# Altium project Coral Dev Board Micro.PrjPcb (part 5 of 5)

## Sheet 15 BOOT.SchDoc: Coral 6 Layer Template With Controlled Impedances
size A2; ApprovedBy: DNP; CheckedBy: DNP; Author: DNP; CompanyName: Google LLC; DrawnBy: DNP; Engineer: Stefan; Organization: Google LLC; Address1: 1600 Amphitheatre Parkway; Address2: Mountain View, CA 94043; Address3: DNP; Address4: DNP; DocumentNumber: 15; Revision: PVT; SheetNumber: 15; SheetTotal: 17; VersionControl_RevNumber: DNP; IsUserConfigurable: DNP; Time: DNP; ImagePath: DNP; Rule: DNP; ProjectName: Enterprise; Application_BuildNumber: DNP
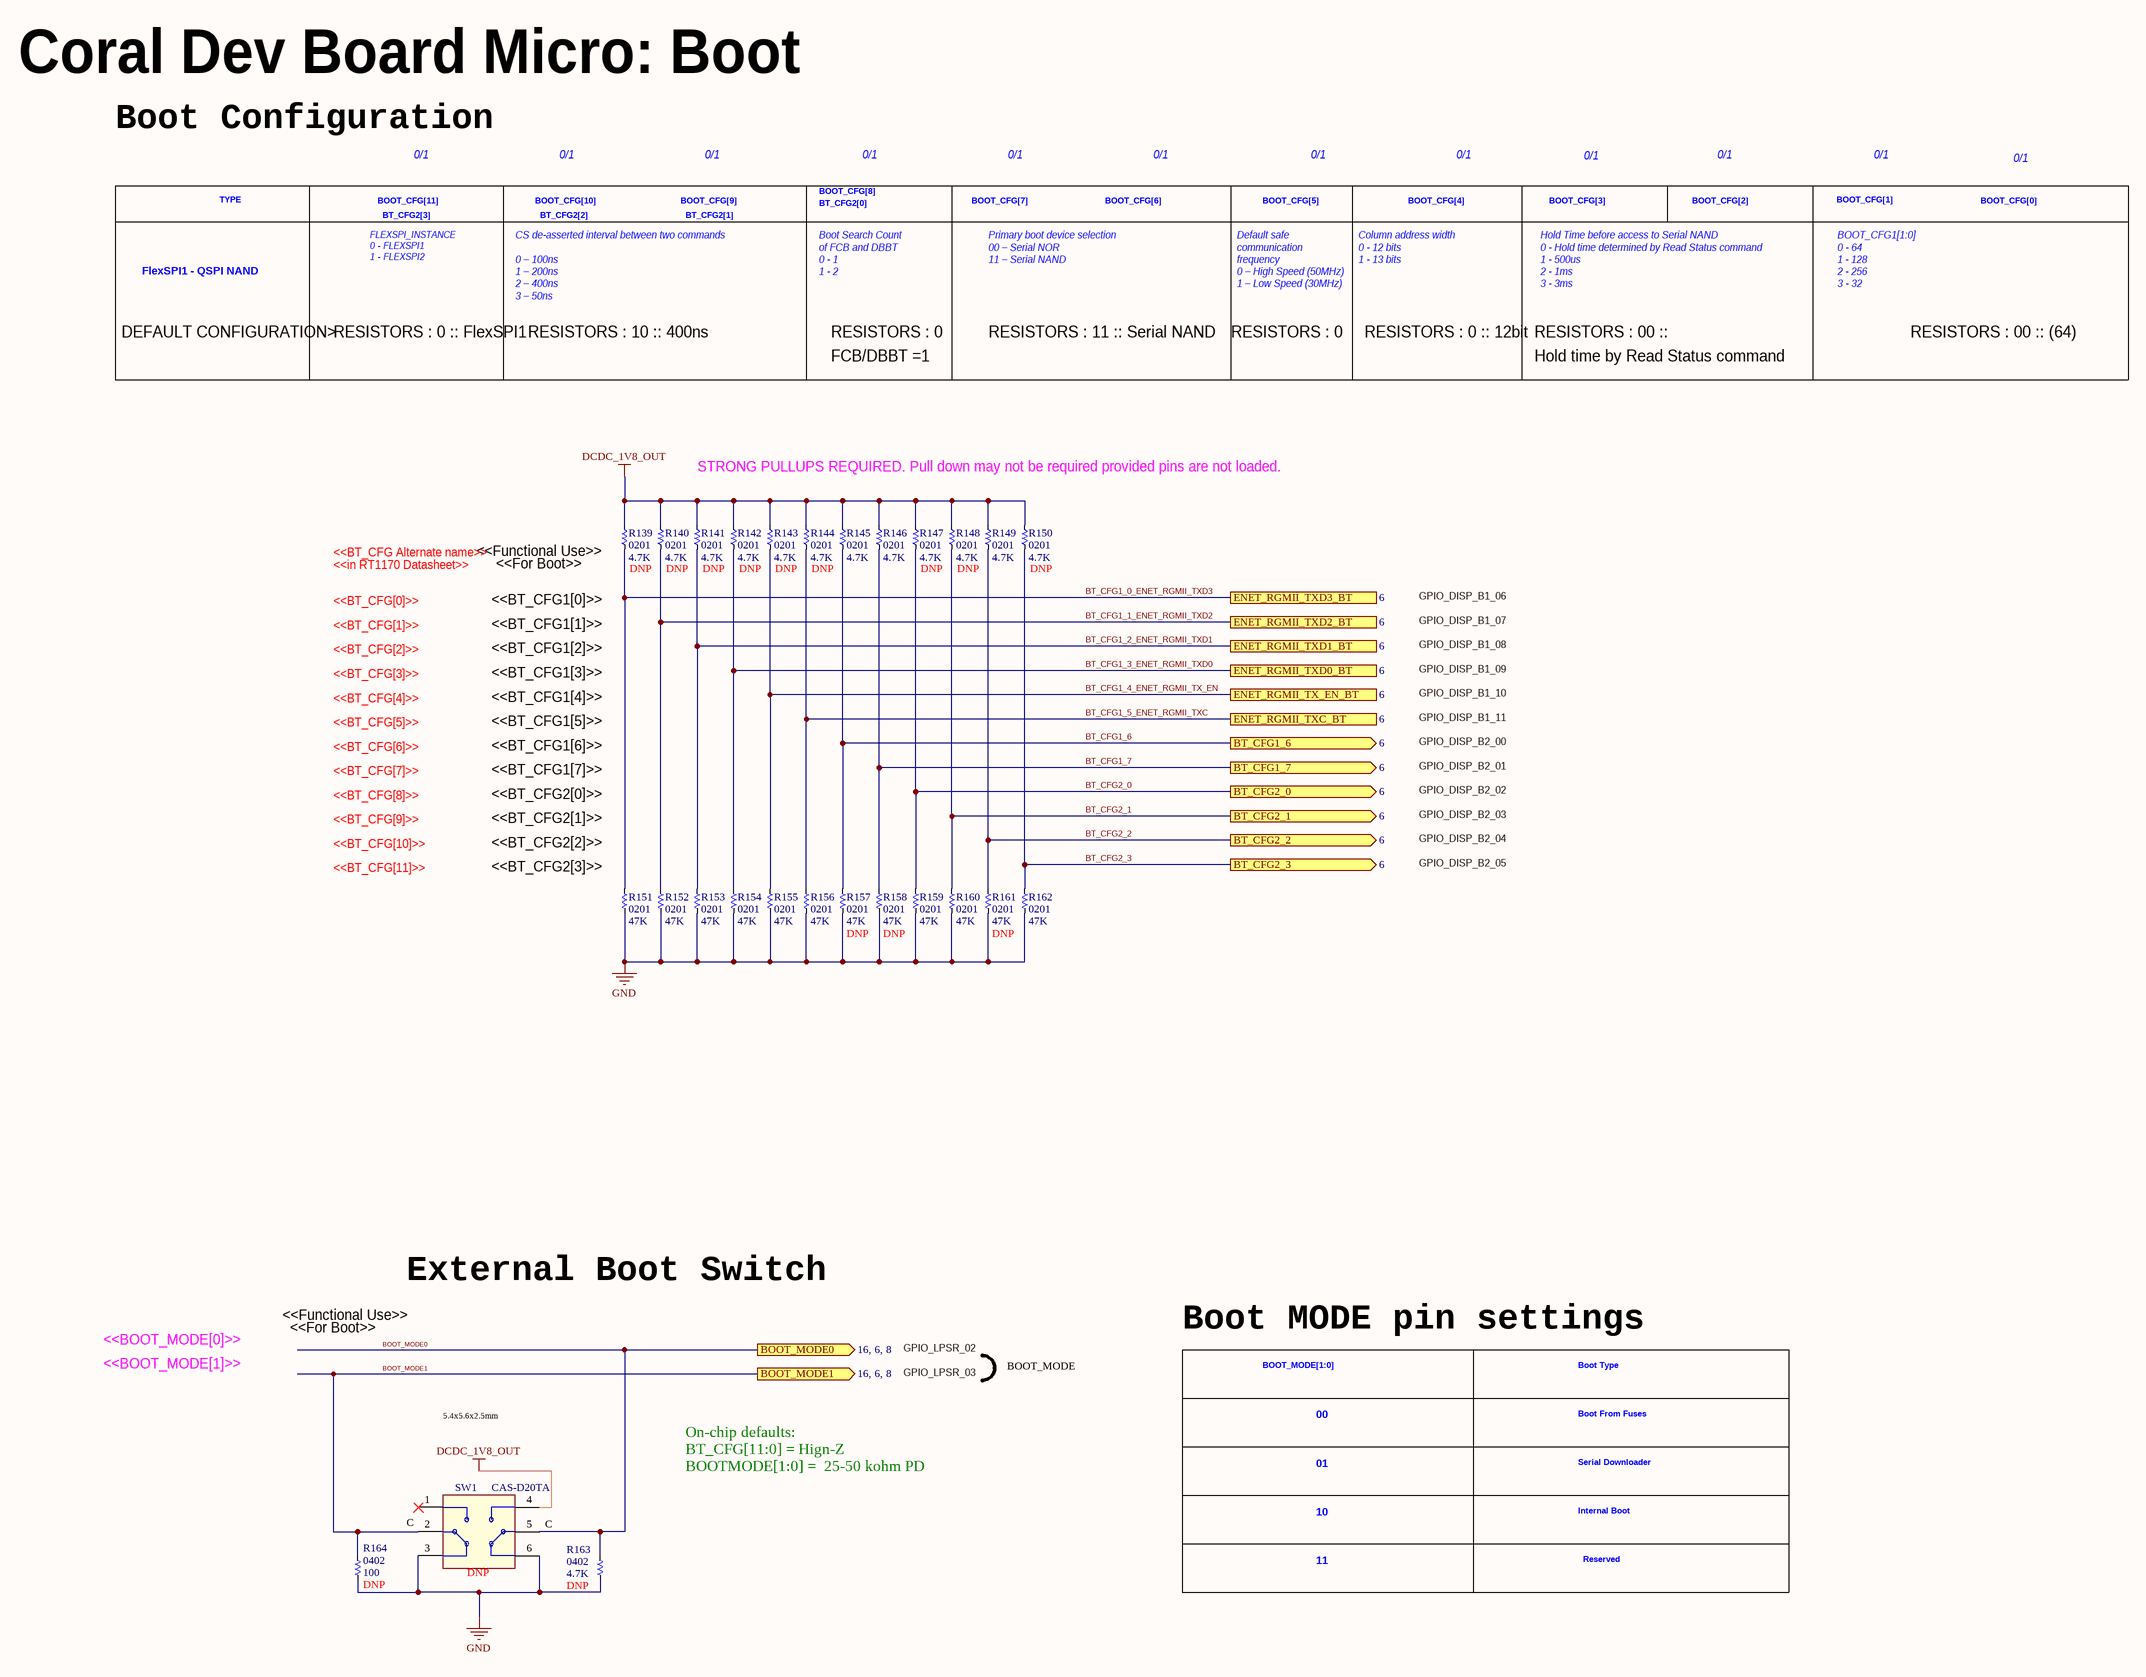
[diagram p20: 15 BOOT.SchDoc]

### Parts
R139  value 4.7K  Package: 0201  [R0201]
R140  value 4.7K  Package: 0201  [R0201]
R141  value 4.7K  Package: 0201  [R0201]
R142  value 4.7K  Package: 0201  [R0201]
R143  value 4.7K  Package: 0201  [R0201]
R144  value 4.7K  Package: 0201  [R0201]
R145  value 4.7K  Package: 0201  [R0201]
R146  value 4.7K  Package: 0201  [R0201]
R147  value 4.7K  Package: 0201  [R0201]
R148  value 4.7K  Package: 0201  [R0201]
R149  value 4.7K  Package: 0201  [R0201]
R150  value 4.7K  Package: 0201  [R0201]
R151  value 47K  Package: 0201  [R0201]
R152  value 47K  Package: 0201  [R0201]
R153  value 47K  Package: 0201  [R0201]
R154  value 47K  Package: 0201  [R0201]
R155  value 47K  Package: 0201  [R0201]
R156  value 47K  Package: 0201  [R0201]
R157  value 47K  Package: 0201  [R0201]
R158  value 47K  Package: 0201  [R0201]
R159  value 47K  Package: 0201  [R0201]
R160  value 47K  Package: 0201  [R0201]
R161  value 47K  Package: 0201  [R0201]
R162  value 47K  Package: 0201  [R0201]
R163  value 4.7K  Package: 0402  [R0402]
R164  value 100  Package: 0402  [R0402]
SW1  MFG P/N: CAS-D20TA  [SWITCH_CAS-D20TA]  (hidden comment: SWITCH_NIDEC_CAS-D20TA)

### Ports
BOOT_MODE0 (out, see 16, 6, 8), BOOT_MODE1 (out, see 16, 6, 8), BT_CFG1_6 (out, see 6), BT_CFG1_7 (out, see 6), BT_CFG2_0 (out, see 6), BT_CFG2_1 (out, see 6), BT_CFG2_2 (out, see 6), BT_CFG2_3 (out, see 6), ENET_RGMII_TX_EN_BT (see 6), ENET_RGMII_TXC_BT (see 6), ENET_RGMII_TXD0_BT (see 6), ENET_RGMII_TXD1_BT (see 6), ENET_RGMII_TXD2_BT (see 6), ENET_RGMII_TXD3_BT (see 6)

### Nets
DCDC_1V8_OUT: R139.2 R140.2 R141.2 R142.2 R143.2 R144.2 R145.2 R146.2 R147.2 R148.2 R149.2 R150.2 SW1.4
GND: R151.2 R152.2 R153.2 R154.2 R155.2 R156.2 R157.2 R158.2 R159.2 R160.2 R161.2 R162.2 R163.1 R164.1 SW1.3 SW1.6
BOOT_MODE0: R163.2 SW1.5 ; port BOOT_MODE0
BOOT_MODE1: R164.2 SW1.2 ; port BOOT_MODE1
BT_CFG1_0_ENET_RGMII_TXD3: R139.1 R151.1 ; port ENET_RGMII_TXD3_BT
BT_CFG1_1_ENET_RGMII_TXD2: R140.1 R152.1 ; port ENET_RGMII_TXD2_BT
BT_CFG1_2_ENET_RGMII_TXD1: R141.1 R153.1 ; port ENET_RGMII_TXD1_BT
BT_CFG1_3_ENET_RGMII_TXD0: R142.1 R154.1 ; port ENET_RGMII_TXD0_BT
BT_CFG1_4_ENET_RGMII_TX_EN: R143.1 R155.1 ; port ENET_RGMII_TX_EN_BT
BT_CFG1_5_ENET_RGMII_TXC: R144.1 R156.1 ; port ENET_RGMII_TXC_BT
BT_CFG1_6: R145.1 R157.1 ; port BT_CFG1_6
BT_CFG1_7: R146.1 R158.1 ; port BT_CFG1_7
BT_CFG2_0: R147.1 R159.1 ; port BT_CFG2_0
BT_CFG2_1: R148.1 R160.1 ; port BT_CFG2_1
BT_CFG2_2: R149.1 R161.1 ; port BT_CFG2_2
BT_CFG2_3: R150.1 R162.1 ; port BT_CFG2_3

Not connected (* = marked no-connect by the designer): SW1 1*

### Notes on the sheet
- Coral Dev Board Micro: Boot
- Boot Configuration
- 0/1
- TYPE
- BOOT_CFG[11]
- BT_CFG2[3]
- BOOT_CFG[10]
- BT_CFG2[2]
- BOOT_CFG[9]
- BT_CFG2[1]
- BOOT_CFG[8]
- BT_CFG2[0]
- BOOT_CFG[7]
- BOOT_CFG[6]
- BOOT_CFG[5]
- BOOT_CFG[4]
- BOOT_CFG[3]
- BOOT_CFG[2]
- BOOT_CFG[1]
- BOOT_CFG[0]
- FlexSPI1 - QSPI NAND
- FLEXSPI_INSTANCE
  0 - FLEXSPI1
  1 - FLEXSPI2
- Boot Search Count
  of FCB and DBBT
  0 - 1
  1 - 2
- Primary boot device selection
  00 – Serial NOR
  11 – Serial NAND
- Column address width
  0 - 12 bits
  1 - 13 bits
- BOOT_CFG1[1:0]
  0 - 64
  1 - 128
  2 - 256
  3 - 32
- DEFAULT CONFIGURATION>
- RESISTORS : 0 :: FlexSPI1
- CS de-asserted interval between two commands
  0 – 100ns
  1 – 200ns
  2 – 400ns
  3 – 50ns
- RESISTORS : 10 :: 400ns
- RESISTORS : 0
- RESISTORS : 11 :: Serial NAND
- Default safe
  communication
  frequency
  0 – High Speed (50MHz)
  1 – Low Speed (30MHz)
- RESISTORS : 0 :: 12bit
- RESISTORS : 00 ::
- Hold Time before access to Serial NAND
  0 - Hold time determined by Read Status command
  1 - 500us
  2 - 1ms
  3 - 3ms
- RESISTORS : 00 :: (64)
- FCB/DBBT =1
- Hold time by Read Status command
- STRONG PULLUPS REQUIRED. Pull down may not be required provided pins are not loaded.
- <<BT_CFG Alternate name>>
- <<in RT1170 Datasheet>>
- (near R139) <<Functional Use>>
- (near R139) <<For Boot>>
- <<BT_CFG[0]>>
- <<BT_CFG[1]>>
- <<BT_CFG1[0]>>
- <<BT_CFG1[1]>>
- GPIO_DISP_B1_06
- GPIO_DISP_B1_07
- GPIO_DISP_B1_08
- <<BT_CFG[2]>>
- <<BT_CFG[3]>>
- <<BT_CFG[4]>>
- <<BT_CFG1[2]>>
- <<BT_CFG1[3]>>
- <<BT_CFG1[4]>>
- GPIO_DISP_B1_09
- GPIO_DISP_B1_10
- <<BT_CFG[5]>>
- <<BT_CFG[6]>>
- <<BT_CFG1[5]>>
- <<BT_CFG1[6]>>
- GPIO_DISP_B1_11
- GPIO_DISP_B2_00
- GPIO_DISP_B2_01
- <<BT_CFG[7]>>
- <<BT_CFG[8]>>
- <<BT_CFG[9]>>
- <<BT_CFG1[7]>>
- <<BT_CFG2[0]>>
- <<BT_CFG2[1]>>
- GPIO_DISP_B2_02
- GPIO_DISP_B2_03
- <<BT_CFG[10]>>
- <<BT_CFG[11]>>
- <<BT_CFG2[2]>>
- (near R151) <<BT_CFG2[3]>>
- GPIO_DISP_B2_04
- GPIO_DISP_B2_05
- External Boot Switch
- <<BOOT_MODE[0]>>
- <<BOOT_MODE[1]>>
- <<For Boot>>
- <<Functional Use>>
- GPIO_LPSR_02
- GPIO_LPSR_03
- BOOT_MODE
- Boot MODE pin settings
- BOOT_MODE[1:0]
- Boot Type
- 5.4x5.6x2.5mm
- 00
- Boot From Fuses
- On-chip defaults:
  BT_CFG[11:0] = Hign-Z
  BOOTMODE[1:0] =  25-50 kohm PD
- 01
- Serial Downloader
- 10
- Internal Boot
- 11
- Reserved
- Project:
- Engineer:
- Date:
- File:
- Revision:
- Sheet
- of
- (in symbol 227) C

### Library data of the parts
R139-R150 = 6602: RES, 4.7K, 5%, 1/20W, 0201; ID: 6602; MFG: YAGEO; MFG P/N: RC0201JR-074K7L; COMMON: 470-00012-00; Status: Released; Power: 1/20W; Tolerance: 5%; LOON: 470-00012-00; Gecko: 470-00012-00; XPN: 470-00012-00
  R139-R144 R147 R148 R150: DNP: DNP
R151-R162 = 6833: RES, 47K, 5%, 1/20W, 0201; ID: 6833; MFG: PANASONIC; MFG P/N: ERJ1GEJ473C; COMMON: 470-00003-00; Status: NRND; Power: 1/20W; Tolerance: 5%; LOON: 470-00003-00; Gecko: 470-00003-00; XPN: 470-00003-00
  R157 R158 R161: DNP: DNP
R163 = 3866: RES, 4.7K, 1%, 1/10W, 0402; ID: 3866; MFG: PANASONIC; MFG P/N: ERJ-2RKF4701X; COMMON: 470-01775-00; PROXY: Use ID #8133; KOI: 470-17107-00; Status: Released; Power: 1/10W; Tolerance: 1%; Height: 0.40mm; Supplier 1: Digi-Key; XPN: 470-01775-00; Supplier Part Number 1: P4.70KLCT-ND; DNP: DNP
R164 = 6318: RES, 100, 5%, 1/16W, 0402, AUTO GRADE; ID: 6318; MFG: VISHAY; MFG P/N: CRCW0402100RJNED; COMMON: 470-02903-00; Status: Released; Power: 1/16W; Tolerance: 5%; XPN: 470-02903-00; DNP: DNP
SW1 = 227: SW, SLIDE, SPDTx2, 100mA, 6VDC, 2-POS, ON-ON, GOLD, SMT; ID: 227; MFG: Nidec Copal Electronics; Voltage, Rated: 6V; Status: Released; Category: Slide Switches; RoHS Compliant: Yes; Supplier 1: Digi-Key; Height: 2.5mm; Mounting Type: SMD; HelpURL: https://www.digikey.com/en/products/detail/nidec-copal-electronics/CAS-D20TA/341665; ComponentLink1Description: Datasheet; ComponentLink1URL: https://drive.google.com/file/d/1yHSGEBNR3CK8ELRyOJmK0djXwn1fRk_2/view; Supplier Part Number 1: CASD20JTR-ND; Features: Tape Seal; Operating Temperature: -40°C ~ 85°C; DNP: DNP

## Sheet 16 INTERFACE.SchDoc: Coral 6 Layer Template With Controlled Impedances
size A2; ApprovedBy: DNP; CheckedBy: DNP; Author: DNP; CompanyName: Google LLC; DrawnBy: DNP; Engineer: Stefan; Organization: Google LLC; Address1: 1600 Amphitheatre Parkway; Address2: Mountain View, CA 94043; Address3: DNP; Address4: DNP; DocumentNumber: 16; Revision: PVT; SheetNumber: 16; SheetTotal: 17; VersionControl_RevNumber: DNP; IsUserConfigurable: DNP; Time: DNP; ImagePath: DNP; Rule: DNP; ProjectName: Enterprise; Application_BuildNumber: DNP
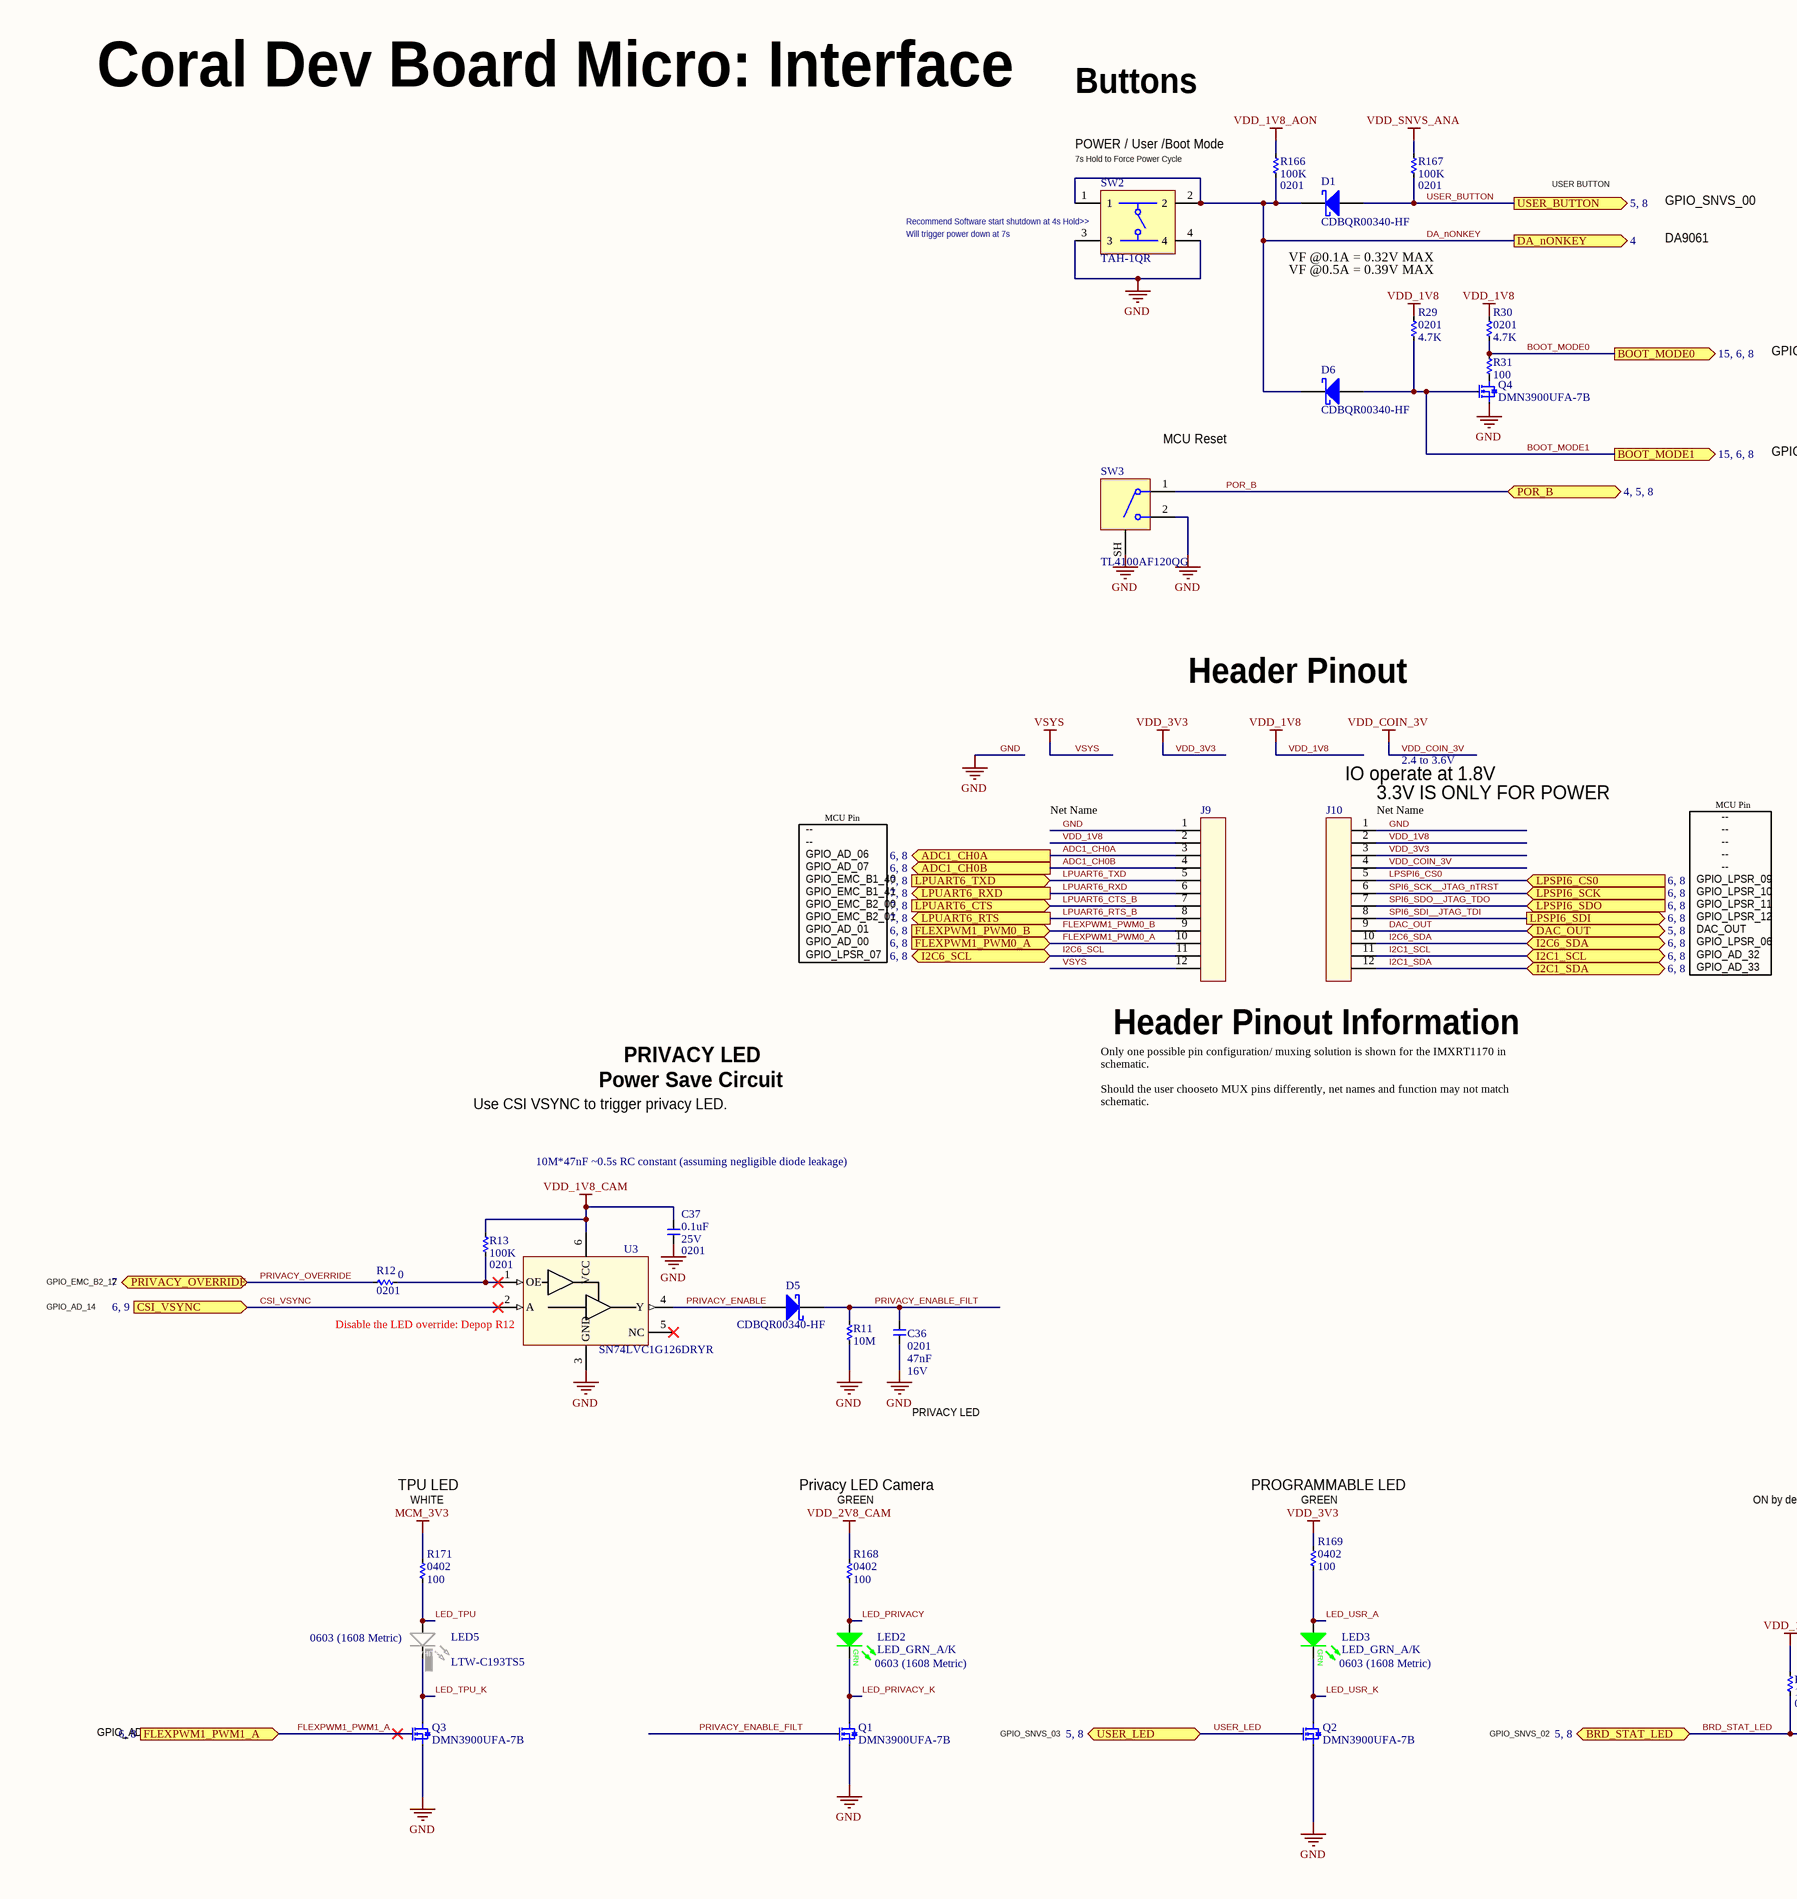
[diagram p21: 16 INTERFACE.SchDoc, left]
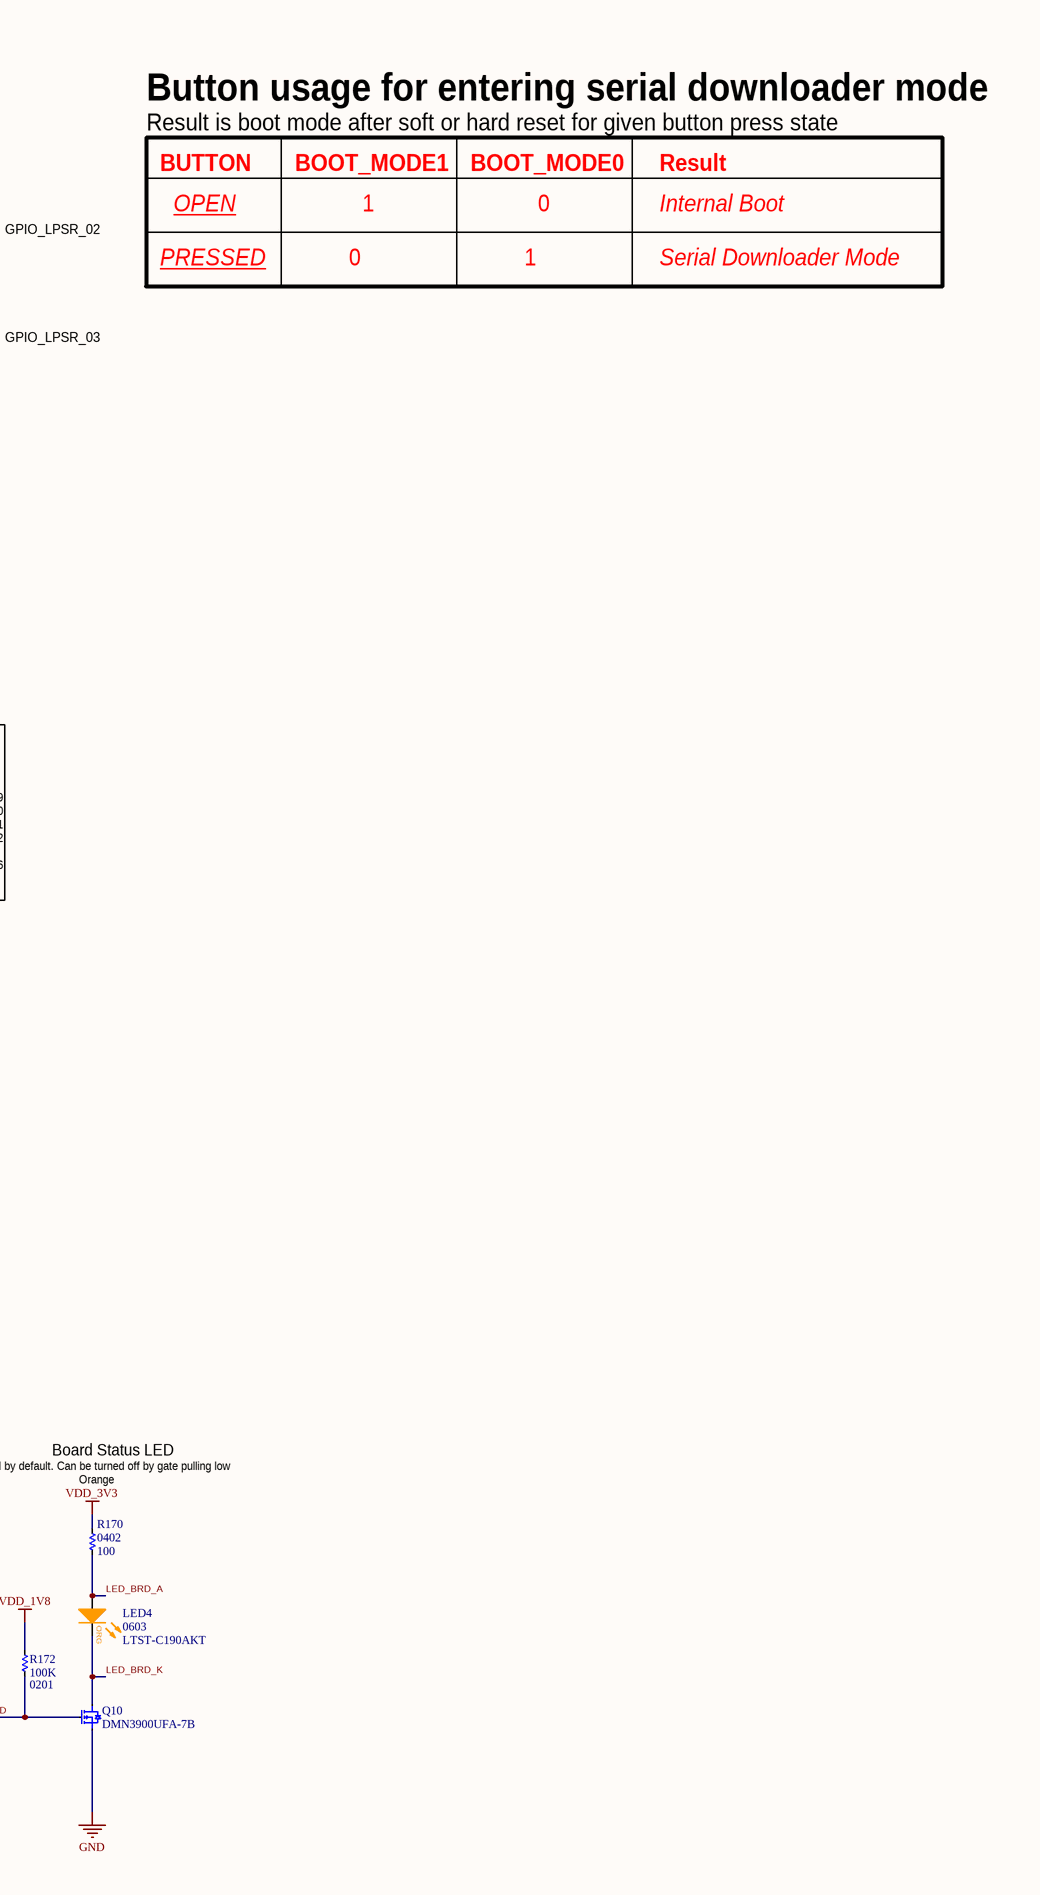
[diagram p22: 16 INTERFACE.SchDoc, right]

### Parts
C36  value 47nF  Package: 0201  Voltage: 16V  [C0201]  (hidden comment: __Template_Cap)
C37  value 0.1uF  Package: 0201  Voltage: 25V  [C0201Y]  (hidden comment: __Template_Cap)
D1  value CDBQR00340-HF  [D0402_H0.55MM]  (hidden comment: __Template_DIODE_SCHOTTKY)
D5  value CDBQR00340-HF  [D0402_H0.55MM]  (hidden comment: __Template_DIODE_SCHOTTKY)
D6  value CDBQR00340-HF  [D0402_H0.55MM]  (hidden comment: __Template_DIODE_SCHOTTKY)
J9  (no value)  [HEADER_1X12_POS_UNSHROUDED]
J10  (no value)  [HEADER_1X12_POS_UNSHROUDED]
LED2  LED_GRN_A/K  Package: 0603 (1608 Metric)  [LED_0603_0.67mm]
LED3  LED_GRN_A/K  Package: 0603 (1608 Metric)  [LED_0603_0.67mm]
LED4  value LTST-C190AKT  Package: 0603  [LED_0603P_ORANGE]  (hidden comment: __Template_LED_ORG)
LED5  value LTW-C193TS5  Package: 0603 (1608 Metric)  [LED_0603P_WHITE]  (hidden comment: __Template_LED_WHT)
Q1  MFG P/N: DMN3900UFA-7B  [3XDFN]  (hidden comment: NFET_DMN3900UFA)
Q2  MFG P/N: DMN3900UFA-7B  [3XDFN]  (hidden comment: NFET_DMN3900UFA)
Q3  MFG P/N: DMN3900UFA-7B  [3XDFN]  (hidden comment: NFET_DMN3900UFA)
Q4  MFG P/N: DMN3900UFA-7B  [3XDFN]  (hidden comment: NFET_DMN3900UFA)
Q10  MFG P/N: DMN3900UFA-7B  [3XDFN]  (hidden comment: NFET_DMN3900UFA)
R11  value 10M  [R0402]
R12  value 0  Package: 0201  [R0201]
R13  value 100K  Package: 0201  [R0201]
R29  value 4.7K  Package: 0201  [R0201]
R30  value 4.7K  Package: 0201  [R0201]
R31  value 100  [R0201]
R166  value 100K  Package: 0201  [R0201]
R167  value 100K  Package: 0201  [R0201]
R168  value 100  Package: 0402  [R0402]
R169  value 100  Package: 0402  [R0402]
R170  value 100  Package: 0402  [R0402]
R171  value 100  Package: 0402  [R0402]
R172  value 100K  Package: 0201  [R0201]
SW2  MFG P/N: TAH-1QR  [SWITCH_TAH1QR]  (hidden comment: SWITCH_TAH1QR)
SW3  MFG P/N: TL4100AF120QG  [SWITCH_TL4100AF120QG]  (hidden comment: SWITCH_E-SWITCH_TL4100AF120QG)
U3  MFG P/N: SN74LVC1G126DRYR  [SON50P145X100X60-6]  (hidden comment: BUF_SN74LVC1G126DRYR)

### Ports
ADC1_CH0A (out, see 6, 8), ADC1_CH0B (out, see 6, 8), BOOT_MODE0 (out, see 15, 6, 8), BOOT_MODE1 (out, see 15, 6, 8), BRD_STAT_LED (bidir, see 5, 8), CSI_VSYNC (in, see 6, 9), DA_nONKEY (out, see 4), DAC_OUT (bidir, see 5, 8), FLEXPWM1_PWM0_A (in, see 6, 8), FLEXPWM1_PWM0_B (in, see 6, 8), FLEXPWM1_PWM1_A (in, see 6, 8), I2C1_SCL (bidir, see 6, 8), I2C1_SDA (bidir, see 6, 8), I2C6_SCL (bidir, see 6, 8), I2C6_SDA (bidir, see 6, 8), LPSPI6_CS0 (in, see 6, 8), LPSPI6_SCK (in, see 6, 8), LPSPI6_SDI (out, see 6, 8), LPSPI6_SDO (in, see 6, 8), LPUART6_CTS (in, see 7, 8), LPUART6_RTS (out, see 7, 8), LPUART6_RXD (out, see 7, 8), LPUART6_TXD (in, see 7, 8), POR_B (bidir, see 4, 5, 8), PRIVACY_OVERRIDE (bidir, see 7), USER_BUTTON (out, see 5, 8), USER_LED (bidir, see 5, 8)

### Nets
GND: C36.2 C37.2 J9.1 J10.1 Q1.2(S) Q2.2(S) Q3.2(S) Q4.2(S) Q10.2(S) R11.1 SW2.3 SW2.4 SW3.2 SW3.SH U3.3(GND)
MCM_3V3: R171.2
VDD_1V8: J9.2 J10.2 R29.2 R30.2 R172.2
VDD_1V8_AON: R166.2
VDD_1V8_CAM: C37.1 R13.2 U3.6(VCC)
VDD_2V8_CAM: R168.2
VDD_3V3: J10.3 R169.2 R170.2
VDD_COIN_3V: J10.4
VDD_SNVS_ANA: R167.2
VSYS: J9.12
ADC1_CH0A: J9.3 ; port ADC1_CH0A
ADC1_CH0B: J9.4 ; port ADC1_CH0B
BOOT_MODE0: R30.1 R31.2 ; port BOOT_MODE0
BOOT_MODE1: D6.A Q4.1(G) R29.1 ; port BOOT_MODE1
BRD_STAT_LED: Q10.1(G) R172.1 ; port BRD_STAT_LED
CSI_VSYNC: U3.2(A) ; port CSI_VSYNC
DA_nONKEY: D1.K D6.K R166.1 SW2.1 SW2.2 ; port DA_nONKEY
DAC_OUT: J10.9 ; port DAC_OUT
FLEXPWM1_PWM0_A: J9.10 ; port FLEXPWM1_PWM0_A
FLEXPWM1_PWM0_B: J9.9 ; port FLEXPWM1_PWM0_B
FLEXPWM1_PWM1_A: Q3.1(G) ; port FLEXPWM1_PWM1_A
I2C1_SCL: J10.11 ; port I2C1_SCL
I2C1_SDA: J10.12 ; port I2C1_SDA
I2C6_SCL: J9.11 ; port I2C6_SCL
I2C6_SDA: J10.10 ; port I2C6_SDA
LED_BRD_A: LED4.2(A) R170.1
LED_BRD_K: LED4.1(K) Q10.3(D)
LED_PRIVACY: LED2.A R168.1
LED_PRIVACY_K: LED2.K Q1.3(D)
LED_TPU: LED5.2(A) R171.1
LED_TPU_K: LED5.1(K) Q3.3(D)
LED_USR_A: LED3.A R169.1
LED_USR_K: LED3.K Q2.3(D)
LPSPI6_CS0: J10.5 ; port LPSPI6_CS0
LPUART6_CTS_B: J9.7 ; port LPUART6_CTS
LPUART6_RTS_B: J9.8 ; port LPUART6_RTS
LPUART6_RXD: J9.6 ; port LPUART6_RXD
LPUART6_TXD: J9.5 ; port LPUART6_TXD
POR_B: SW3.1 ; port POR_B
PRIVACY_ENABLE: D5.A U3.4(Y)
PRIVACY_ENABLE_FILT: C36.1 D5.K Q1.1(G) R11.2
PRIVACY_OVERRIDE: R12.2 ; port PRIVACY_OVERRIDE
SPI6_SCK__JTAG_nTRST: J10.6 ; port LPSPI6_SCK
SPI6_SDI__JTAG_TDI: J10.8 ; port LPSPI6_SDI
SPI6_SDO__JTAG_TDO: J10.7 ; port LPSPI6_SDO
USER_BUTTON: D1.A R167.1 ; port USER_BUTTON
USER_LED: Q2.1(G) ; port USER_LED
NetQ4_3: Q4.3(D) R31.1
NetR12_1: R12.1 R13.1 U3.1(OE)

Not connected (* = marked no-connect by the designer): U3 5(NC)*

### Notes on the sheet
- Coral Dev Board Micro: Interface
- Buttons
- POWER / User /Boot Mode
- (near SW2) 7s Hold to Force Power Cycle
- (near SW2) Recommend Software start shutdown at 4s Hold>>
- Will trigger power down at 7s
- USER BUTTON
- GPIO_SNVS_00
- Button usage for entering serial downloader mode
- VF @0.1A = 0.32V MAX
- VF @0.5A = 0.39V MAX
- DA9061
- Result is boot mode after soft or hard reset for given button press state
- BUTTON
- BOOT_MODE1
- BOOT_MODE0
- Result
- GPIO_LPSR_02
- OPEN
- 1
- 0
- Internal Boot
- PRESSED
- Serial Downloader Mode
- (near SW3) MCU Reset
- GPIO_LPSR_03
- Header Pinout
- IO operate at 1.8V
- 3.3V IS ONLY FOR POWER
- 2.4 to 3.6V
- MCU Pin
- GPIO_AD_06
- --
- Net Name
- (near J10) Net Name
- GPIO_EMC_B1_40
- GPIO_EMC_B1_41
- GPIO_EMC_B2_00
- GPIO_EMC_B2_01
- GPIO_AD_01
- GPIO_AD_07
- GPIO_LPSR_09
- GPIO_LPSR_10
- GPIO_LPSR_11
- GPIO_LPSR_12
- DAC_OUT
- GPIO_AD_00
- GPIO_LPSR_07
- GPIO_AD_32
- GPIO_AD_33
- GPIO_LPSR_06
- Header Pinout Information
- Power Save Circuit
- PRIVACY LED
- Only one possible pin configuration/ muxing solution is shown for the IMXRT1170 in schematic.
  Should the user chooseto MUX pins differently, net names and function may not match schematic.
- Use CSI VSYNC to trigger privacy LED.
  Discharge RC time constant approximately 500ms. Likely to be shorter due to leakage paths.
- 10M*47nF ~0.5s RC constant (assuming negligible diode leakage)
- GPIO_EMC_B2_12
- GPIO_AD_14
- (near U3) Disable the LED override: Depop R12
- TPU LED
- Privacy LED Camera
- PROGRAMMABLE LED
- Board Status LED
- WHITE
- GREEN
- (near R169) GREEN
- ON by default. Can be turned off by gate pulling low
- (near R170) Orange
- GPIO_AD_02
- GPIO_SNVS_03
- GPIO_SNVS_02
- Project:
- Engineer:
- Date:
- File:
- Revision:
- Sheet
- of
- (in symbol 61) ORG
- (in symbol 197) GRN

### Library data of the parts
C36 = 799: CAP, CER, X6S, 0.047uF, 16V, 10%, 0201, 0.33mm T; ID: 799; MFG: TDK; MFG P/N: C0603X6S1C473K030BC; XPN: 150-00153-00; Status: NRND; Dielectric: X6S; Tolerance: 10%; Height: 0.33mm T; ComponentLink1Description: Datasheet; COMMON: 150-00153-00
C37 = 386: CAP, CER, X5R, 0.1uF, 25V, 20%, 0201, 0.33mm T; ID: 386; MFG: MURATA; MFG P/N: GRM033R61E104ME14D; XPN: 150-01204-00; Status: Released; Dielectric: X5R; Tolerance: 20%; Height: 0.33mm T; ComponentLink1Description: Datasheet; COMMON: 150-01204-00; LOON: 150-01204-00; Gecko: 150-01204-00
D1 D5 D6 = 353: DIODE, SCHOTTKY, 40V VRRM, 30mA IO, 500mA SURGE, 0402; ID: 353; MFG: Comchip Technology; Voltage – Forward (VF) (MAX) @ IF: 370 mV @ 1 mA; Current - Reverse Leakage @ VR: 1 µA @ 40 V; Status: Released; MFG P/N: CDBQR00340-HF; Package: 0402; Category: DIODE; RoHS Compliant: Yes; Diode Type: Schottky; Mounting Type: SMD; Voltage - DC Reverse (VR) (MAX): 40V; Current - Average Rectified (IO): 30mA; Operating Temperature – Junction: 125°C (Max); Supplier 1: Digi-Key; HelpURL: https://www.digikey.com/en/products/detail/comchip-technology/CDBQR00340-HF/3308478?s=N4IgTCBcDaIMIBEBCBFASgBgwZgCwYFoAJAMRAF0BfIA; ComponentLink1Description: Datasheet; ComponentLink1URL: https://www.comchiptech.com/admin/files/product/QW-G1106%20CDBQR00340-HF%20RevB.pdf; Height: 0.55mm; Supplier Part Number 1: 641-1978-2-ND
J9 J10 = 366: CONN, HDR, TH, STR, 1X12, 2.54mmP; ID: 366; MFG: SULLINS; MFG P/N: PBC12SAAN; COMMON: 210-00118-00; Status: Released; RoHS Compliant: Yes; LOON: 210-00118-00; XPN: 210-00118-00; Gecko: 210-00118-00
LED2 LED3 = 197: LED, GREEN, 570nm, 25mA, DIFFUSED, 0603; ID: 197; MFG: OSRAM Opto Semiconductors Inc.; MFG P/N: LG L29K-G2J1-24-Z; Value: LG L29K-G2J1-24-Z; Voltage – Forward (VF) (MAX) @ IF: 1.7V; COMMON: 370-00021-00; PROXY: 370-00433-00; Status: In Development; Category: LED; RoHS Compliant: Yes; Diode Type: LED; Mounting Type: SMD; Supplier 1: Digi-Key; HelpURL: https://www.digikey.in/product-detail/en/osram-opto-semiconductors-inc/LG-L29K-G2J1-24-Z/475-2709-1-ND/1938876; ComponentLink1Description: Datasheet; ComponentLink1URL: https://dammedia.osram.info/media/resource/hires/osram-dam-2493945/LG%20L29K.pdf; LOON: 370-00021-00; Color / Wavelength: GREEN; Supplier Part Number 1: 475-2709-1-ND
LED4 = 61: LED, ORANGE, 610NM, WATER CLEAR, GAP, 0603; ID: 61; MFG: Lite-On Technology Corp; Current - Average Rectified (IO): 10mA; Voltage – Forward (VF) (MAX) @ IF: 2.1V; PROXY: 246-00083-00; XPN: XS-10006042; Gecko: 370-00585-00; Orbital: 370-00646-00; Status: Released; MFG P/N: LTST-C190AKT; Category: Diode; Diode Type: LED; Mounting Type: SM; Operating Temperature – Junction: -40°C ~ 85°C; Supplier 1: Digi-Key; HelpURL: http://media.digikey.com/pdf/Data%20Sheets/Lite-On%20PDFs/LTST-C190AKT.pdf; ComponentLink1Description: Datasheet; ComponentLink1URL: http://media.digikey.com/pdf/Data%20Sheets/Lite-On%20PDFs/LTST-C190AKT.pdf; Color / Wavelength: ORANGE; Supplier Part Number 1: 160-1180-1-ND
LED5 = 69: LED, WHITE, 0603, SMD; ID: 69; MFG: Lite-On Technology Corp; Current - Average Rectified (IO): 5mA; Voltage – Forward (VF) (MAX) @ IF: 2.93V; COMMON: 246-00092-00; KOI: 370-00551-00; XPN: XS-10006051; Status: Released; MFG P/N: LTW-C193TS5; Category: Diode; Diode Type: LED; Mounting Type: SM; Operating Temperature – Junction: -20°C ~ +80°C; Supplier 1: Digi-Key; HelpURL: http://optoelectronics.liteon.com/upload/download/DS22-2004-203/S_110_LTW-C193TS5.pdf; ComponentLink1Description: Datasheet; ComponentLink1URL: http://optoelectronics.liteon.com/upload/download/DS22-2004-203/S_110_LTW-C193TS5.pdf; LOON: 246-00092-00; Gecko: 246-00092-00; Color / Wavelength: WHITE; Supplier Part Number 1: 160-1721-1-ND
Q1-Q4 Q10 = 24: MOSFET, N-CH, 30V, 0.55A, DMN3900; ID: 24; MFG: Diodes Incorporated; FET Type: MOSFET N-Channel, Metal Oxide; FET Feature: Logic Level Gate; Current - Continuios Drain (ID) @ 25° C: 550mA; RDS On (Max) @ ID, VGS: 760 mOhm @ 200mA, 4.5V; VGS(TH) (Max) @ ID: 950mV @ 250µA; Gate Charge (QG) @ VGS: 0.7nC @ 4.5V; Input Capacitance (CISS) @ VDS: 42.2pF @ 25V; Power - Max: 390mW; COMMON: 480-00750-00; XPN: XS-10020699; EES: 480-01751-00; Status: Released; Package: 3-XFDFN; Category: Discrete Semiconductor Products; RoHS Compliant: Yes; HelpURL: http://www.diodes.com/datasheets/DMN3900UFA.pdf; ComponentLink1Description: Datasheet; ComponentLink1URL: http://www.diodes.com/datasheets/DMN3900UFA.pdf; Voltage - Drain To Source (VDSS): 30V; Mounting Type: SM; Supplier 1: Digi-Key; Supplier Part Number 1: DMN3900UFA-7BCT-ND
R11 = 6216: Resistor, 10.0M Ohms, 0402, 0.063W, ±1%; ID: 6216; MFG: YAGEO; MFG P/N: RC0402FR-0710ML; Power: 1/16W; COMMON: 470-09411-00; XPN: XS-10019877; Status: Released; Package: 0402; Tolerance: 1%; Height: 0.40mm; Supplier 1: Digi-Key; Supplier Part Number 1: 311-10.0MLRCT-ND
R12 = 8315: RES, 0.0, 1/20W, 0201; ID: 8315; MFG: PANASONIC; MFG P/N: ERJ1GN0R00C; Tolerance: JUMPER; COMMON: 470-00013-00; PROXY: Use ID #6940; Status: Released; Power: 1/20W; LOON: 470-00013-00; Gecko: 470-00013-00; XPN: 470-00013-00
R13 R166 R167 R172 = 7818: RES, 100K, 1%, 1/20W, 0201; ID: 7818; MFG: PANASONIC; MFG P/N: ERJ1GEF1003C; COMMON: 470-00506-00; Status: NRND; Power: 1/20W; Tolerance: 1%; LOON: 470-00506-00; Gecko: 470-00506-00; XPN: 470-00506-00
R29 R30 = 6602: as R139-R150 on sheet 15 BOOT; Status: Released; Power: 1/20W; Tolerance: 5%; LOON: 470-00012-00; Gecko: 470-00012-00; XPN: 470-00012-00
R31 = 6785: RES, 100, 5%, 1/20W, 0201; ID: 6785; MFG: YAGEO; MFG P/N: RC0201JR-07100RL; COMMON: 470-00473-00; Status: Released; Package: 0201; Power: 1/20W; Tolerance: 5%; XPN: 470-00473-00
R168-R171 = 6318: as R164 on sheet 15 BOOT; Status: Released; Power: 1/16W; Tolerance: 5%; XPN: 470-02903-00
SW2 = 205: SW, TACT, SPST, 0.05A, 16VDC, OVAL ACTUATOR, SMD; ID: 205; MFG: Diptronics; Status: Released; Category: TACTILE SWITCH; RoHS Compliant: Yes; Supplier 1: Mouser; Height: 2.7mm; Mounting Type: SMD; HelpURL: https://www.mouser.com/ProductDetail/Diptronics/TAH-1QR?qs=%2Fha2pyFaduipOSvjgYeYPSjN0bL8fZLbb5mXZs85d5Y%3D; ComponentLink1Description: Datasheet; ComponentLink1URL: https://drive.google.com/file/d/13CKM1hC869BRhfaIa7pbNI_rAmBVZshp/view; Supplier Part Number 1: 113-TAH-1QR; Operating Temperature: -30°C ~ 85°C; Voltage, Rated: 16 VDC
SW3 = 224: SW, TACT, SPST-NO, OFF-MOM, 0.05A, 12VDC, RA, EDGE MOUNT; ID: 224; Status: Released; MFG: E-Switch; Category: Tactile Switches; RoHS Compliant: Yes; Supplier 1: Digi-Key; Height: 1.35mm; Mounting Type: SMD; HelpURL: https://www.digikey.com/en/products/detail/e-switch/TL4100AF120QG/2685028?s=N4IgTCBcDaICoBkAsBGADGgggMRWNAigOIgC6AvkA; ComponentLink1Description: Datasheet; ComponentLink1URL: http://spec_sheets.e-switch.com/specs/P004000.pdf; Supplier Part Number 1: EG4963TR-ND; Operating Temperature: -40°C ~ 85°C
U3 = 438: IC, BUFFER, 74LVC1G126, NON-INVERT, SINGLE ELEMENT, 3-STATE O/P, 32mA, 1.65V TO 5.5V VIN, UFDFN-6; ID: 438; MFG: Texas Instruments; Status: Released; Package: 6-SON (1.45x1); Category: Integrated Circuits (ICs); RoHS Compliant: Yes; Supplier 1: Digi-Key; ComponentLink1Description: Datasheet; ComponentLink1URL: https://www.ti.com/lit/ds/symlink/sn74lvc1g126.pdf?HQS=dis-dk-null-digikeymode-dsf-pf-null-wwe&ts=1622160361458; Mounting Type: SMD; Height: 0.6mm; Supplier Part Number 1: 296-SN74LVC1G126DRYRTR-ND; HelpURL: https://www.digikey.com/en/products/detail/texas-instruments/SN74LVC1G126DRYR/1591998?s=N4IgTCBcDaIMoDkDsAWAMgNQMIEYDiOYAbACIBKAmmSALoC%2BQA

## Sheet 17 Revision History.SchDoc: Coral 6 Layer Template With Controlled Impedances
size A2; Engineer: Stefan; DocumentNumber: 17; Revision: PVT; SheetNumber: 17; SheetTotal: 17; VersionControl_RevNumber: DNP; IsUserConfigurable: DNP
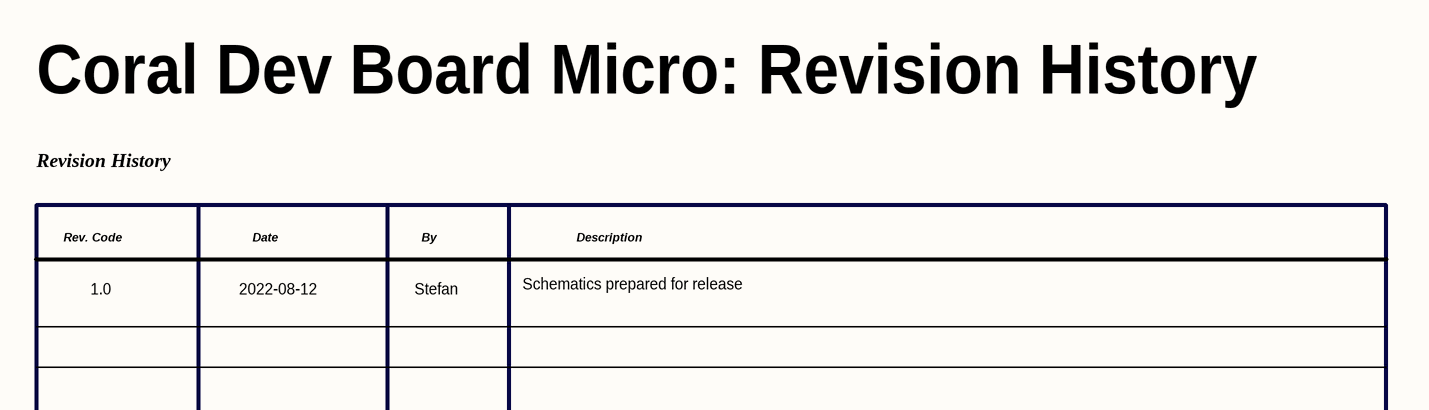
[diagram p23: 17 Revision History.SchDoc, left]
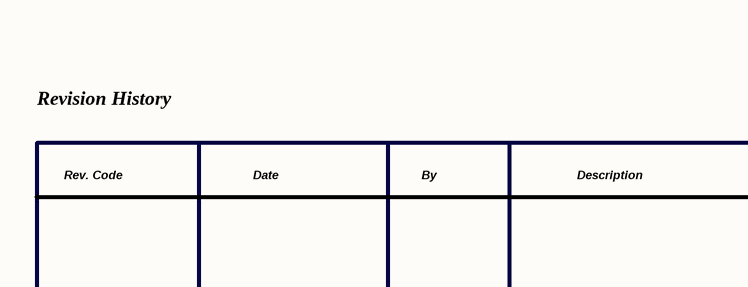
[diagram p24: 17 Revision History.SchDoc, right]

### Notes on the sheet
- Coral Dev Board Micro: Revision History
- Revision History
- Rev. Code
- Date
- By
- Description
- 1.0
- 2022-08-12
- Stefan
- Schematics prepared for release
- Project:
- Proprietary and Confidential
- Engineer:
- Date:
- File:
- Revision:
- Sheet
- of

## Nets that join several sheets
DCDC_1V8_OUT: 04 MAIN POWER (R7.2), 05 MIMXRT1170 PART1 (C279.1 FB2.1 R416.2 U5.M6), 06 MIMXRT1170 PART2 (R23.2 R24.2 R373.2 R374.2), 08 B2B (C19.1 C22.1 J6.10), 15 BOOT (13 pins)
DCDC_1V8_OUT_SENSE: 05 MIMXRT1170 PART1 (7 pins), 08 B2B (J6.12)
GND: 04 MAIN POWER (32 pins), 05 MIMXRT1170 PART1 (87 pins), 06 MIMXRT1170 PART2 (17 pins), 07 MIMXRT1170 PART3 (11 pins), 08 B2B (58 pins), 09 Parallel Camera (15 pins), 10 FLASH_BOOT (C81.2 C82.2 U17.4), 11 SDRAM (17 pins), 12 DMIC (7 pins), 13 USB (11 pins), 14 TPU (115 pins), 15 BOOT (16 pins), 16 INTERFACE (15 pins)
MCM_1V8: 06 MIMXRT1170 PART2 (U10.3 U10.7), 07 MIMXRT1170 PART3 (U5.P2), 14 TPU (7 pins)
MCM_3V3: 07 MIMXRT1170 PART3 (C251.1 U5.D16), 08 B2B (J6.6), 14 TPU (29 pins), 16 INTERFACE (R171.2)
MCM_3V3_SENSE: 08 B2B (J6.8), 14 TPU (R22.1 U21.4)
VDD_1V8: 04 MAIN POWER (C23.1 C24.1 C25.1 R3.2), 06 MIMXRT1170 PART2 (28 pins), 07 MIMXRT1170 PART3 (11 pins), 08 B2B (6 pins), 10 FLASH_BOOT (R71.2), 11 SDRAM (FB6.1), 13 USB (U4.1), 16 INTERFACE (5 pins)
VDD_1V8_AON: 04 MAIN POWER (5 pins), 08 B2B (J6.3), 16 INTERFACE (R166.2)
VDD_1V8_CAM: 04 MAIN POWER (C14.1 TP7.1 U1.9), 06 MIMXRT1170 PART2 (U13.3 U13.7), 08 B2B (J6.2), 09 Parallel Camera (C31.1 C79.1 J7.11), 16 INTERFACE (C37.1 R13.2 U3.6)
VDD_1V8_MIC: 04 MAIN POWER (C15.1 TP26.1 U1.11), 08 B2B (J6.4), 12 DMIC (C20.1 C83.1 U19.4)
VDD_1V8_SENSE: 04 MAIN POWER (6 pins), 08 B2B (J6.47)
VDD_2V8_CAM: 04 MAIN POWER (C13.1 TP2.1 U1.2), 08 B2B (J6.1), 09 Parallel Camera (C27.1 C29.1 J7.2), 16 INTERFACE (R168.2)
VDD_3V3: 04 MAIN POWER (6 pins), 05 MIMXRT1170 PART1 (5 pins), 07 MIMXRT1170 PART3 (FB5.1), 08 B2B (5 pins), 14 TPU (U21.1), 16 INTERFACE (J10.3 R169.2 R170.2)
VDD_3V3_SENSE: 04 MAIN POWER (6 pins), 08 B2B (J6.31)
VDD_COIN_3V: 05 MIMXRT1170 PART1 (D3.A), 08 B2B (J5.83), 16 INTERFACE (J10.4)
VDD_LPSR_IN: 05 MIMXRT1170 PART1 (C300.1 R415.2 TP15.1 U5.R12), 08 B2B (J6.13)
VDD_SNVS_ANA: 05 MIMXRT1170 PART1 (6 pins), 16 INTERFACE (R167.2)
VDDA_1P0: 05 MIMXRT1170 PART1 (C276.1 U5.N11), 07 MIMXRT1170 PART3 (R1848.1), 08 B2B (J6.5)
VSYS: 04 MAIN POWER (9 pins), 05 MIMXRT1170 PART1 (C18.1 U2.3 U2.4), 06 MIMXRT1170 PART2 (R40.2), 08 B2B (7 pins), 16 INTERFACE (J9.12)
VUSB: 04 MAIN POWER (R8.2), 07 MIMXRT1170 PART3 (C252.1 U5.D17), 13 USB (8 pins)
ADC1_CH0A: 06 MIMXRT1170 PART2 (U5.N13), 08 B2B (J5.10), 16 INTERFACE (J9.3)
ADC1_CH0B: 06 MIMXRT1170 PART2 (U5.T17), 08 B2B (J5.14), 16 INTERFACE (J9.4)
ADC1_CH2B: 06 MIMXRT1170 PART2 (U5.P16), 08 B2B (J5.6)
BOOT_MODE0: 06 MIMXRT1170 PART2 (U5.P6), 08 B2B (J6.19), 15 BOOT (R163.2 SW1.5), 16 INTERFACE (R30.1 R31.2)
BOOT_MODE1: 06 MIMXRT1170 PART2 (U5.T7), 08 B2B (J6.21), 15 BOOT (R164.2 SW1.2), 16 INTERFACE (D6.A Q4.1 R29.1)
BRD_STAT_LED: 05 MIMXRT1170 PART1 (U5.L9), 08 B2B (J5.80), 16 INTERFACE (Q10.1 R172.1)
BT_CFG1_0_ENET_RGMII_TXD3: 06 MIMXRT1170 PART2 (R10.2 U5.D10), 15 BOOT (R139.1 R151.1)
BT_CFG1_1_ENET_RGMII_TXD2: 06 MIMXRT1170 PART2 (R16.2 U5.E12), 15 BOOT (R140.1 R152.1)
BT_CFG1_2_ENET_RGMII_TXD1: 06 MIMXRT1170 PART2 (R18.2 U5.A15), 15 BOOT (R141.1 R153.1)
BT_CFG1_3_ENET_RGMII_TXD0: 06 MIMXRT1170 PART2 (R19.2 U5.C13), 15 BOOT (R142.1 R154.1)
BT_CFG1_4_ENET_RGMII_TX_EN: 06 MIMXRT1170 PART2 (R20.2 U5.B14), 15 BOOT (R143.1 R155.1)
BT_CFG1_5_ENET_RGMII_TXC: 06 MIMXRT1170 PART2 (R26.2 U5.A14), 15 BOOT (R144.1 R156.1)
BT_CFG1_6: 06 MIMXRT1170 PART2 (U5.E8), 15 BOOT (R145.1 R157.1)
BT_CFG1_7: 06 MIMXRT1170 PART2 (U5.F8), 15 BOOT (R146.1 R158.1)
BT_CFG2_0: 06 MIMXRT1170 PART2 (U5.E9), 15 BOOT (R147.1 R159.1)
BT_CFG2_1: 06 MIMXRT1170 PART2 (U5.D7), 15 BOOT (R148.1 R160.1)
BT_CFG2_2: 06 MIMXRT1170 PART2 (U5.C7), 15 BOOT (R149.1 R161.1)
BT_CFG2_3: 06 MIMXRT1170 PART2 (U5.C9), 15 BOOT (R150.1 R162.1)
BT_DEV_WAKE: 06 MIMXRT1170 PART2 (U5.A7), 08 B2B (J6.62)
BT_HOST_WAKE: 06 MIMXRT1170 PART2 (U5.A4), 08 B2B (J6.50)
BT_REG_ON: 06 MIMXRT1170 PART2 (U5.G17), 08 B2B (J5.87)
CAMERA_INT: 05 MIMXRT1170 PART1 (U5.P9), 08 B2B (J5.33), 09 Parallel Camera (J7.9)
CAMERA_TRIG: 07 MIMXRT1170 PART3 (U5.T2), 09 Parallel Camera (J7.4)
CSI_DATA02: 06 MIMXRT1170 PART2 (U5.J12), 09 Parallel Camera (J7.17)
CSI_DATA03: 06 MIMXRT1170 PART2 (U5.K12), 09 Parallel Camera (J7.18)
CSI_DATA04: 06 MIMXRT1170 PART2 (U5.K14), 09 Parallel Camera (J7.19)
CSI_DATA05: 06 MIMXRT1170 PART2 (U5.K13), 09 Parallel Camera (J7.20)
CSI_DATA06: 06 MIMXRT1170 PART2 (U5.L16), 09 Parallel Camera (J7.21)
CSI_DATA07: 06 MIMXRT1170 PART2 (U5.M16), 09 Parallel Camera (J7.22)
CSI_DATA08: 06 MIMXRT1170 PART2 (U5.N15), 09 Parallel Camera (J7.23)
CSI_DATA09: 06 MIMXRT1170 PART2 (U5.N17), 09 Parallel Camera (J7.24)
CSI_HSYNC: 06 MIMXRT1170 PART2 (U5.M14), 09 Parallel Camera (J7.6)
CSI_MCLK: 06 MIMXRT1170 PART2 (R44.2), 09 Parallel Camera (J7.14)
CSI_PIXCLK: 06 MIMXRT1170 PART2 (U5.P17), 09 Parallel Camera (J7.16)
CSI_VSYNC: 06 MIMXRT1170 PART2 (U5.N14), 09 Parallel Camera (J7.5), 16 INTERFACE (U3.2)
DA_GPIO0_WDOG_KICK: 04 MAIN POWER (TP27.1 U1.21), 05 MIMXRT1170 PART1 (U5.P10), 08 B2B (J5.55)
DA_GPIO2: 04 MAIN POWER (U1.28), 08 B2B (J5.63)
DA_GPIO3: 04 MAIN POWER (U1.29), 08 B2B (J5.65)
DA_GPIO4_SYS_EN: 04 MAIN POWER (R6.2 R7.1 R9.2 U1.30), 08 B2B (J5.67)
DA_nIRQ: 04 MAIN POWER (TP6.1 U1.37), 08 B2B (J5.61)
DA_nONKEY: 04 MAIN POWER (U1.15), 16 INTERFACE (5 pins)
DA_nRESET: 04 MAIN POWER (TP5.1 U1.38), 08 B2B (J5.59)
DA_nRESETREQ: 04 MAIN POWER (R4.1 U1.16), 08 B2B (J5.74)
DAC_OUT: 05 MIMXRT1170 PART1 (D31.K U5.H16), 08 B2B (J5.95), 16 INTERFACE (J10.9)
DMIC_DATA0: 06 MIMXRT1170 PART2 (U5.R6), 08 B2B (J5.45), 12 DMIC (R87.2)
DMIC_DATA1: 06 MIMXRT1170 PART2 (R37.1 R38.2 U5.U6), 08 B2B (J5.43)
DMIC_DATA2__JTAG_TCK: 06 MIMXRT1170 PART2 (TP21.1 U5.T6), 08 B2B (J5.41)
DMIC_DATA3__JTAG_TMS: 06 MIMXRT1170 PART2 (TP24.1 U5.U7), 08 B2B (J5.39)
ENET_RGMII_MDC: 07 MIMXRT1170 PART3 (U5.U2), 08 B2B (J6.44)
ENET_RGMII_MDIO: 07 MIMXRT1170 PART3 (U5.R3), 08 B2B (J6.46)
ENET_RGMII_RX_EN: 06 MIMXRT1170 PART2 (U5.E13), 08 B2B (J6.76)
ENET_RGMII_RXC: 06 MIMXRT1170 PART2 (U5.D13), 08 B2B (J6.78)
ENET_RGMII_RXD0: 06 MIMXRT1170 PART2 (U5.D11), 08 B2B (J6.70)
ENET_RGMII_RXD1: 06 MIMXRT1170 PART2 (U5.E11), 08 B2B (J6.68)
ENET_RGMII_RXD2: 06 MIMXRT1170 PART2 (U5.E10), 08 B2B (J6.66)
ENET_RGMII_RXD3: 06 MIMXRT1170 PART2 (U5.C11), 08 B2B (J6.72)
ENET_RGMII_TX_EN: 06 MIMXRT1170 PART2 (R20.1), 08 B2B (J6.63)
ENET_RGMII_TXC: 06 MIMXRT1170 PART2 (R26.1), 08 B2B (J6.65)
ENET_RGMII_TXD0: 06 MIMXRT1170 PART2 (R19.1), 08 B2B (J6.61)
ENET_RGMII_TXD1: 06 MIMXRT1170 PART2 (R18.1), 08 B2B (J6.59)
ENET_RGMII_TXD2: 06 MIMXRT1170 PART2 (R16.1), 08 B2B (J6.57)
ENET_RGMII_TXD3: 06 MIMXRT1170 PART2 (R10.1), 08 B2B (J6.55)
ETHPHY_RST_B: 07 MIMXRT1170 PART3 (U5.R1), 08 B2B (J6.42)
FLEXPWM1_PWM0_A: 06 MIMXRT1170 PART2 (U5.N12), 08 B2B (J5.9), 16 INTERFACE (J9.10)
FLEXPWM1_PWM0_B: 06 MIMXRT1170 PART2 (U5.R14), 08 B2B (J5.7), 16 INTERFACE (J9.9)
FLEXPWM1_PWM1_A: 06 MIMXRT1170 PART2 (U5.R13), 08 B2B (J5.11), 16 INTERFACE (Q3.1)
FLEXPWM1_PWM1_B: 06 MIMXRT1170 PART2 (U5.P15), 08 B2B (J5.5)
FLEXPWM2_PWM1_A: 06 MIMXRT1170 PART2 (U5.L14), 08 B2B (J5.3)
FLEXPWM2_PWM1_B: 06 MIMXRT1170 PART2 (U5.N16), 08 B2B (J5.1)
FlexSPI_A_CLK: 06 MIMXRT1170 PART2 (U5.G14), 10 FLASH_BOOT (R75.1)
FlexSPI_A_D0: 06 MIMXRT1170 PART2 (U5.F15), 10 FLASH_BOOT (R76.1)
FlexSPI_A_D1: 06 MIMXRT1170 PART2 (U5.H15), 10 FLASH_BOOT (R78.1)
FlexSPI_A_D2: 06 MIMXRT1170 PART2 (U5.H14), 10 FLASH_BOOT (R85.1)
FlexSPI_A_D3: 06 MIMXRT1170 PART2 (U5.F16), 10 FLASH_BOOT (R84.1)
FlexSPI_A_SS0: 06 MIMXRT1170 PART2 (U5.F17), 10 FLASH_BOOT (R79.1)
GPIO_SNVS_04: 05 MIMXRT1170 PART1 (U5.N10), 08 B2B (J5.58)
GPIO_SNVS_06: 05 MIMXRT1170 PART1 (U5.M9), 08 B2B (J5.78)
GPIO_SNVS_07: 05 MIMXRT1170 PART1 (U5.R9), 08 B2B (J5.34)
GPIO_SNVS_08: 05 MIMXRT1170 PART1 (U5.N9), 08 B2B (J5.56)
I2C1_SCL: 06 MIMXRT1170 PART2 (R46.1 U5.K16), 08 B2B (J5.51), 16 INTERFACE (J10.11)
I2C1_SDA: 06 MIMXRT1170 PART2 (R47.1 U5.H17), 08 B2B (J5.52), 16 INTERFACE (J10.12)
I2C5_SCL: 04 MAIN POWER (U1.14), 06 MIMXRT1170 PART2 (5 pins), 08 B2B (J5.17)
I2C5_SCL_CAM: 06 MIMXRT1170 PART2 (U13.6), 09 Parallel Camera (J7.7)
I2C5_SCL_MCM: 06 MIMXRT1170 PART2 (U10.6), 14 TPU (TP41.1 U23.50)
I2C5_SDA: 04 MAIN POWER (U1.13), 06 MIMXRT1170 PART2 (5 pins), 08 B2B (J5.15)
I2C5_SDA_CAM: 06 MIMXRT1170 PART2 (U13.2), 09 Parallel Camera (J7.8)
I2C5_SDA_MCM: 06 MIMXRT1170 PART2 (U10.2), 14 TPU (TP42.1 U23.49)
I2C6_SCL: 06 MIMXRT1170 PART2 (R51.1 U5.R8), 08 B2B (J5.35), 16 INTERFACE (J9.11)
I2C6_SDA: 06 MIMXRT1170 PART2 (R50.1 U5.P8), 08 B2B (J5.72), 16 INTERFACE (J10.10)
LPSPI1_PCS0: 06 MIMXRT1170 PART2 (U5.M17), 08 B2B (J6.71)
LPSPI1_SCK: 06 MIMXRT1170 PART2 (U5.L17), 08 B2B (J6.69)
LPSPI1_SDI: 06 MIMXRT1170 PART2 (U5.J17), 08 B2B (J6.75)
LPSPI1_SDO: 06 MIMXRT1170 PART2 (U5.K17), 08 B2B (J6.73)
LPSPI6_CS0: 06 MIMXRT1170 PART2 (U5.P5), 08 B2B (J5.50), 16 INTERFACE (J10.5)
LPUART1_RXD: 06 MIMXRT1170 PART2 (U14.5), 08 B2B (J5.91)
LPUART1_TXD: 06 MIMXRT1170 PART2 (U14.1), 08 B2B (J5.89)
LPUART2_CTS_B: 06 MIMXRT1170 PART2 (R45.2), 08 B2B (J6.56)
LPUART2_RTS_B: 06 MIMXRT1170 PART2 (U5.A5), 08 B2B (J6.54)
LPUART2_RXD: 06 MIMXRT1170 PART2 (U5.A6), 08 B2B (J6.60)
LPUART2_TXD: 06 MIMXRT1170 PART2 (U5.D9), 08 B2B (J6.58)
LPUART6_CTS_B: 07 MIMXRT1170 PART3 (U5.K2), 08 B2B (J5.24), 16 INTERFACE (J9.7)
LPUART6_RTS_B: 07 MIMXRT1170 PART3 (U5.K4), 08 B2B (J5.47), 16 INTERFACE (J9.8)
LPUART6_RXD: 07 MIMXRT1170 PART3 (TP31.1 U5.L1), 08 B2B (J5.22), 16 INTERFACE (J9.6)
LPUART6_TXD: 07 MIMXRT1170 PART3 (TP30.1 U5.K1), 08 B2B (J5.2), 16 INTERFACE (J9.5)
LPUART8_RXD: 06 MIMXRT1170 PART2 (U5.D8), 08 B2B (J5.82)
LPUART8_TXD: 06 MIMXRT1170 PART2 (U5.B5), 08 B2B (J6.52)
MCM_SD_ALARM: 07 MIMXRT1170 PART3 (U5.L4), 14 TPU (TP37.1 U23.82)
MIC_CLK: 06 MIMXRT1170 PART2 (U5.N6), 08 B2B (J5.97), 12 DMIC (R86.1)
MIPI_CSI_CK_N: 07 MIMXRT1170 PART3 (U5.A12), 08 B2B (J6.94)
MIPI_CSI_CK_P: 07 MIMXRT1170 PART3 (U5.B12), 08 B2B (J6.92)
MIPI_CSI_D0_N: 07 MIMXRT1170 PART3 (U5.A11), 08 B2B (J6.88)
MIPI_CSI_D0_P: 07 MIMXRT1170 PART3 (U5.B11), 08 B2B (J6.86)
MIPI_CSI_D1_N: 07 MIMXRT1170 PART3 (U5.A13), 08 B2B (J6.100)
MIPI_CSI_D1_P: 07 MIMXRT1170 PART3 (U5.B13), 08 B2B (J6.98)
MIPI_DSI_CK_N: 07 MIMXRT1170 PART3 (U5.A9), 08 B2B (J6.87)
MIPI_DSI_CK_P: 07 MIMXRT1170 PART3 (U5.B9), 08 B2B (J6.85)
MIPI_DSI_D0_N: 07 MIMXRT1170 PART3 (U5.A8), 08 B2B (J6.81)
MIPI_DSI_D0_P: 07 MIMXRT1170 PART3 (U5.B8), 08 B2B (J6.79)
MIPI_DSI_D1_N: 07 MIMXRT1170 PART3 (U5.A10), 08 B2B (J6.93)
MIPI_DSI_D1_P: 07 MIMXRT1170 PART3 (U5.B10), 08 B2B (J6.91)
ONOFF: 05 MIMXRT1170 PART1 (U5.U10), 08 B2B (J5.30)
OTG1_D_N: 07 MIMXRT1170 PART3 (U5.E16), 13 USB (L7.2)
OTG1_D_P: 07 MIMXRT1170 PART3 (U5.E17), 13 USB (L7.3)
PMIC_ON_REQ: 04 MAIN POWER (R6.1), 05 MIMXRT1170 PART1 (R1821.1 TP13.1 U5.U9), 08 B2B (J5.29)
PMIC_STBY_REQ: 05 MIMXRT1170 PART1 (TP12.1 U5.T9), 08 B2B (J5.32)
POR_B: 04 MAIN POWER (U1.22), 05 MIMXRT1170 PART1 (C115.1 R215.1 U5.T10), 08 B2B (J5.60), 16 INTERFACE (SW3.1)
PRIVACY_OVERRIDE: 07 MIMXRT1170 PART3 (U5.M2), 16 INTERFACE (R12.2)
RGMII1_PHY_INTB: 07 MIMXRT1170 PART3 (U5.K3), 08 B2B (J6.40)
SAI2_MCLK: 07 MIMXRT1170 PART3 (U5.M1), 08 B2B (J5.66)
SAI2_RX_BCLK: 07 MIMXRT1170 PART3 (U5.T1), 08 B2B (J5.42)
SAI2_RX_DATA: 07 MIMXRT1170 PART3 (U5.M3), 08 B2B (J5.68)
SAI2_RX_SYNC: 07 MIMXRT1170 PART3 (U5.N1), 08 B2B (J5.62)
SAI2_TX_BCLK: 07 MIMXRT1170 PART3 (U5.N2), 08 B2B (J5.64)
SAI2_TX_DATA: 07 MIMXRT1170 PART3 (U5.P1), 08 B2B (J5.53)
SAI2_TX_SYNC: 07 MIMXRT1170 PART3 (U5.R2), 08 B2B (J5.40)
SEMC_A0: 07 MIMXRT1170 PART3 (U5.A3), 11 SDRAM (U18.H7)
SEMC_A1: 07 MIMXRT1170 PART3 (U5.A2), 11 SDRAM (U18.H8)
SEMC_A2: 07 MIMXRT1170 PART3 (U5.C2), 11 SDRAM (U18.J8)
SEMC_A3: 07 MIMXRT1170 PART3 (U5.C5), 11 SDRAM (U18.J7)
SEMC_A4: 07 MIMXRT1170 PART3 (U5.D5), 11 SDRAM (U18.J3)
SEMC_A5: 07 MIMXRT1170 PART3 (U5.B1), 11 SDRAM (U18.J2)
SEMC_A6: 07 MIMXRT1170 PART3 (U5.C1), 11 SDRAM (U18.H3)
SEMC_A7: 07 MIMXRT1170 PART3 (U5.D3), 11 SDRAM (U18.H2)
SEMC_A8: 07 MIMXRT1170 PART3 (U5.B3), 11 SDRAM (U18.H1)
SEMC_A9: 07 MIMXRT1170 PART3 (U5.B4), 11 SDRAM (U18.G3)
SEMC_A10: 07 MIMXRT1170 PART3 (U5.B2), 11 SDRAM (U18.H9)
SEMC_A11: 07 MIMXRT1170 PART3 (U5.C4), 11 SDRAM (U18.G2)
SEMC_A12: 07 MIMXRT1170 PART3 (U5.C3), 11 SDRAM (U18.G1)
SEMC_BA0: 07 MIMXRT1170 PART3 (U5.G2), 11 SDRAM (U18.G7)
SEMC_BA1: 07 MIMXRT1170 PART3 (U5.H2), 11 SDRAM (U18.G8)
SEMC_CAS: 07 MIMXRT1170 PART3 (U5.J5), 11 SDRAM (U18.F7)
SEMC_CKE: 07 MIMXRT1170 PART3 (U5.G5), 11 SDRAM (R135.2 U18.F3)
SEMC_CLK: 07 MIMXRT1170 PART3 (U5.J3), 11 SDRAM (R365.1)
SEMC_CS0: 07 MIMXRT1170 PART3 (U5.E6), 11 SDRAM (R90.1 U18.G9)
SEMC_D0: 07 MIMXRT1170 PART3 (U5.F3), 11 SDRAM (U18.A8)
SEMC_D1: 07 MIMXRT1170 PART3 (U5.F2), 11 SDRAM (U18.B9)
SEMC_D2: 07 MIMXRT1170 PART3 (U5.G4), 11 SDRAM (U18.B8)
SEMC_D3: 07 MIMXRT1170 PART3 (U5.E4), 11 SDRAM (U18.C9)
SEMC_D4: 07 MIMXRT1170 PART3 (U5.H5), 11 SDRAM (U18.C8)
SEMC_D5: 07 MIMXRT1170 PART3 (U5.F4), 11 SDRAM (U18.D9)
SEMC_D6: 07 MIMXRT1170 PART3 (U5.H4), 11 SDRAM (U18.D8)
SEMC_D7: 07 MIMXRT1170 PART3 (U5.H3), 11 SDRAM (U18.E9)
SEMC_D8: 07 MIMXRT1170 PART3 (U5.E3), 11 SDRAM (U18.E1)
SEMC_D9: 07 MIMXRT1170 PART3 (U5.D2), 11 SDRAM (U18.D2)
SEMC_D10: 07 MIMXRT1170 PART3 (U5.D1), 11 SDRAM (U18.D1)
SEMC_D11: 07 MIMXRT1170 PART3 (U5.E2), 11 SDRAM (U18.C2)
SEMC_D12: 07 MIMXRT1170 PART3 (U5.E1), 11 SDRAM (U18.C1)
SEMC_D13: 07 MIMXRT1170 PART3 (U5.F1), 11 SDRAM (U18.B2)
SEMC_D14: 07 MIMXRT1170 PART3 (U5.G1), 11 SDRAM (U18.B1)
SEMC_D15: 07 MIMXRT1170 PART3 (U5.H1), 11 SDRAM (U18.A2)
SEMC_DM0: 07 MIMXRT1170 PART3 (U5.F5), 11 SDRAM (U18.E8)
SEMC_DM1: 07 MIMXRT1170 PART3 (U5.J1), 11 SDRAM (U18.F1)
SEMC_RAS: 07 MIMXRT1170 PART3 (U5.J4), 11 SDRAM (U18.F8)
SEMC_WE: 07 MIMXRT1170 PART3 (U5.E5), 11 SDRAM (U18.F9)
SPI6_SCK__JTAG_nTRST: 06 MIMXRT1170 PART2 (TP18.1 U5.R5), 08 B2B (J5.48), 16 INTERFACE (J10.6)
SPI6_SDI__JTAG_TDI: 06 MIMXRT1170 PART2 (TP20.1 U5.U5), 08 B2B (J5.44), 16 INTERFACE (J10.8)
SPI6_SDO__JTAG_TDO: 06 MIMXRT1170 PART2 (TP19.1 U5.T5), 08 B2B (J5.46), 16 INTERFACE (J10.7)
TPU_BOOT_FAIL: 07 MIMXRT1170 PART3 (U5.K5), 14 TPU (U23.85)
TPU_POW_EN: 07 MIMXRT1170 PART3 (U5.L2), 14 TPU (R39.2 U21.3)
TPU_RST_L: 07 MIMXRT1170 PART3 (U5.M4), 14 TPU (R136.2 U23.76)
USB2_TPU_N: 07 MIMXRT1170 PART3 (U5.C16), 14 TPU (R133.1)
USB2_TPU_P: 07 MIMXRT1170 PART3 (U5.C17), 14 TPU (R132.1)
USB_OTG1_ID: 06 MIMXRT1170 PART2 (R43.2), 13 USB (U20.9)
USB_PORT_RT: 06 MIMXRT1170 PART2 (U5.R15), 13 USB (R17.2 U4.2)
USDHC2_CLK: 06 MIMXRT1170 PART2 (U5.F14), 08 B2B (J5.79)
USDHC2_CMD: 06 MIMXRT1170 PART2 (R23.1 U5.E14), 08 B2B (J5.81)
USDHC2_DATA0: 06 MIMXRT1170 PART2 (R24.1 U5.E15), 08 B2B (J5.77)
USDHC2_DATA1: 06 MIMXRT1170 PART2 (U5.H13), 08 B2B (J5.73)
USDHC2_DATA2: 06 MIMXRT1170 PART2 (U5.J14), 08 B2B (J5.75)
USDHC2_DATA3: 06 MIMXRT1170 PART2 (U5.J15), 08 B2B (J5.71)
USER_BUTTON: 05 MIMXRT1170 PART1 (U5.R10), 08 B2B (J5.31), 16 INTERFACE (D1.A R167.1)
USER_LED: 05 MIMXRT1170 PART1 (U5.M10), 08 B2B (J5.25), 16 INTERFACE (Q2.1)
WAKEUP: 05 MIMXRT1170 PART1 (TP9.1 U5.T8), 08 B2B (J5.36)
WIFI_POWER_EN: 05 MIMXRT1170 PART1 (U5.R11), 08 B2B (J5.27)
WIFI_SDIO_CLK: 06 MIMXRT1170 PART2 (U5.D15), 08 B2B (J5.92)
WIFI_SDIO_CMD: 06 MIMXRT1170 PART2 (R32.2), 08 B2B (J5.100)
WIFI_SDIO_D0: 06 MIMXRT1170 PART2 (R33.2), 08 B2B (J5.96)
WIFI_SDIO_D1: 06 MIMXRT1170 PART2 (R34.2), 08 B2B (J5.94)
WIFI_SDIO_D2: 06 MIMXRT1170 PART2 (R35.2), 08 B2B (J5.85)
WIFI_SDIO_D3: 06 MIMXRT1170 PART2 (R36.2), 08 B2B (J5.98)
WL_ANT_SEL: 06 MIMXRT1170 PART2 (U5.C6), 08 B2B (J5.88)
WL_HOST_WAKE: 06 MIMXRT1170 PART2 (U5.D6), 08 B2B (J5.86)
WL_REG_ON: 06 MIMXRT1170 PART2 (U5.J16), 08 B2B (J5.93)

## Assembly variants
Production: not fitted C39 C40 C41 C43 C44 C46 C109 C110 J9 J10 R15 R21 R25 R37 R53 R73 R74 R90 R116 R125 R135 R139 R140 R141 R142 R143 R144 R147 R148 R150 R157 R158 R161 R163 R164 R164 R189 R397 SW1